# Altium schematic sheet 1,Архитектура.SchDoc
size A4; SheetNumber: 1; SheetTotal: 2
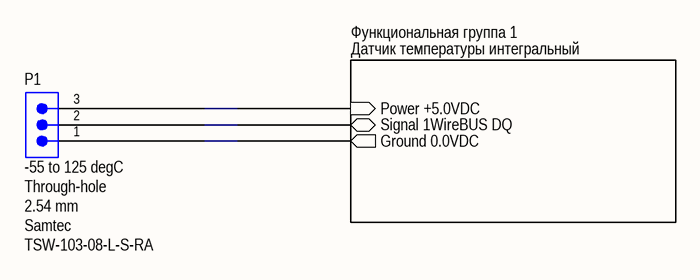
[diagram p0: 1,Архитектура.SchDoc]

## Parts
P1  Temperature Range: -55 to 125 degC  Mounting Technology: Through-hole  Pitch: 2.54 mm  Manufacturer: Samtec  [SMTC-TSW-103-08-X-S-RA]  (hidden comment: TSW-103-08-L-S-RA)

## Sub-sheets
Функциональная группа 1 = 2,ФБ1,Чертеж,Схема_принципиальная.SchDoc: Signal 1WireBUS DQ (bidir), Power +5.0VDC (in), Ground 0.0VDC (out)  | Функция: Датчик температуры интегральный

## Nets
NetP1_1: P1.1 ; sheet Функциональная группа 1/Ground 0.0VDC
NetP1_2: P1.2 ; sheet Функциональная группа 1/Signal 1WireBUS DQ
NetP1_3: P1.3 ; sheet Функциональная группа 1/Power +5.0VDC

## Library data of the parts
P1 = CMP-1024-00343-1: 0.025" SQ Post Header, Through-hole, Right Angle, -55 to 125 degC, 2.54 mm Pitch, 3-Pin, Male, RoHS; ComponentLink2Description: Datasheet; ComponentLink1Description: Manufacturer URL; ComponentLink3URL: http://www.samtec.com/documents/webfiles/cpdf/TSW-XXX-XX-XXX-X-XX-XXX-MKT.pdf; DatasheetVersion: F-214; PackageDescription: .025[0.64] SQ. Post Terminal Strip Assembly; PackageVersion: DM, 8/1988; Orientation: Right Angle; PackageReference: TSW-103-08-X-S-RA; ComponentLink1URL: http://www.samtec.com; ComponentLink3Description: Package Specification; PartNumber: TSW-103-08-L-S-RA; RoHS: True; ComponentLink2URL: http://www.samtec.com/documents/webfiles/pdf/TSW_TH.PDF